# Altium schematic sheet Sheet1.SchDoc
size A4
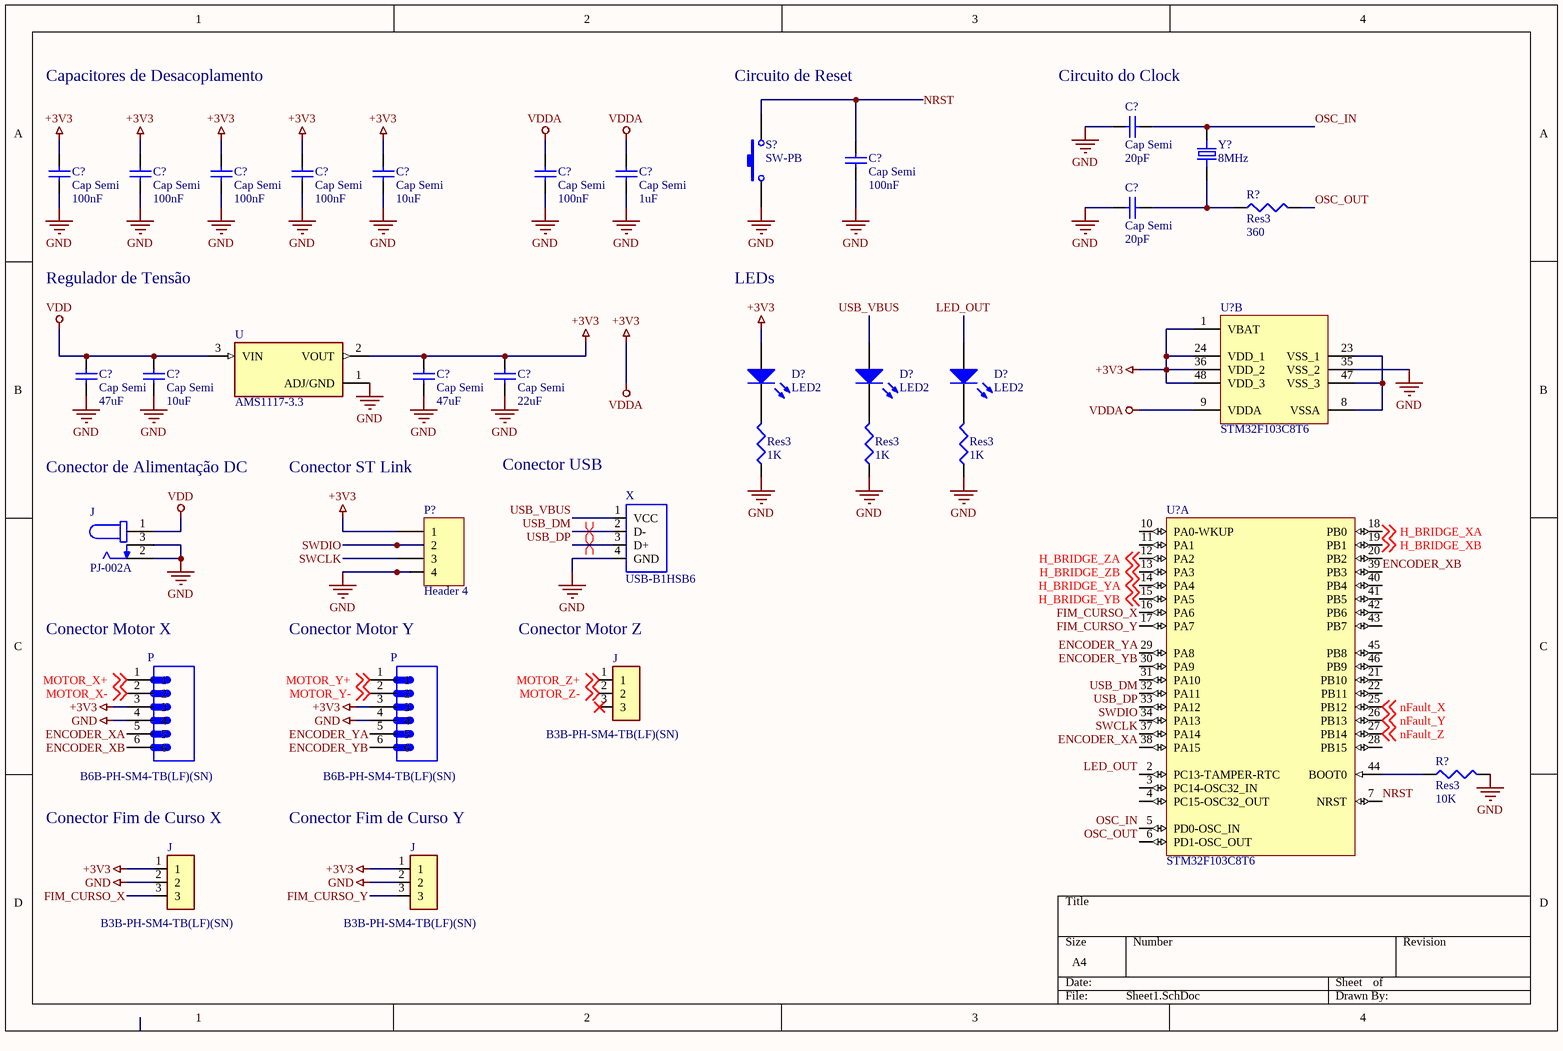
[diagram p0: Sheet1.SchDoc]

## Parts
(Parts that share a designator on the sheet are numbered #1, #2 ... from top to bottom, then left to right.)
?#1  Res3  value 1K  [14-1210]
?#2  Res3  value 1K  [J1-0603]
?#3  Res3  value 1K  [J1-0603]
C?#1  Cap Semi  value 20pF  [C1206]
C?#2  Cap Semi  value 100nF  [C1206]
C?#3  Cap Semi  value 100nF  [C1206]
C?#4  Cap Semi  value 100nF  [C1206]
C?#5  Cap Semi  value 100nF  [C1206]
C?#6  Cap Semi  value 100nF  [C1206]
C?#7  Cap Semi  value 10uF  [C1206]
C?#8  Cap Semi  value 100nF  [C1206]
C?#9  Cap Semi  value 1uF  [C1206]
C?#10  Cap Semi  value 20pF  [C1206]
C?#11  Cap Semi  value 47uF  [C1206]
C?#12  Cap Semi  value 10uF  [C1206]
C?#13  Cap Semi  value 47uF  [C1206]
C?#14  Cap Semi  value 22uF  [C1206]
D?#1  LED2  [3.2X1.6X1.1]
D?#2  LED2  [3.2X1.6X1.1]
D?#3  LED2  [3.2X1.6X1.1]
J#1  PJ-002A  [CUI_PJ-002A]
J#2  B3B-PH-SM4-TB(LF)(SN)  [JST_B3B-PH-SM4-TB(LF)(SN)]
J#3  B3B-PH-SM4-TB(LF)(SN)  [JST_B3B-PH-SM4-TB(LF)(SN)]
J#4  B3B-PH-SM4-TB(LF)(SN)  [JST_B3B-PH-SM4-TB(LF)(SN)]
P#1  B6B-PH-SM4-TB(LF)(SN)  [JST_B6B-PH-SM4-TB(LF)(SN)]
P#2  B6B-PH-SM4-TB(LF)(SN)  [JST_B6B-PH-SM4-TB(LF)(SN)]
P?  Header 4  [HDR1X4]
R?#1  Res3  value 360  [J1-0603]
R?#2  Res3  value 10K  [J1-0603]
S?  SW-PB  [SPST-2]
U  AMS1117-3.3  [SOT229P700X180-4N]
U?#1  STM32F103C8T6  [STM-LQFP48_N]  (part B of 2)
U?#2  STM32F103C8T6  [STM-LQFP48_N]  (part A of 2)
X  USB-B1HSB6  [OST_USB-B1HSB6]
Y?  8MHz  [XTAL_ECS-80-20-5PX-TR]

## Nets
+3V3: C?#3.2 C?#4.2 C?#5.2 C?#6.2 C?#7.2 C?#8.2 C?#9.2 C?#13.2 C?#14.2 D?#1.1(A) J#3.1 J#4.1 P#1.3 P#2.3 P?.1 U.2(VOUT) U?#1.1(VBAT) U?#1.9(VDDA) U?#1.24(VDD_1) U?#1.36(VDD_2) U?#1.48(VDD_3)  [also labelled VDDA]
GND: ?#1.1 ?#2.1 ?#3.1 C?#1.2 C?#2.1 C?#3.1 C?#4.1 C?#5.1 C?#6.1 C?#7.1 C?#8.1 C?#9.1 C?#10.2 C?#11.1 C?#12.1 C?#13.1 C?#14.1 J#1.2 J#1.3 J#3.2 J#4.2 P#1.4 P#2.4 P?.4 R?#2.2 S?.1 U.1(ADJ/GND) U?#1.35(VSS_2) X.4(GND)
VDD: C?#11.2 C?#12.2 J#1.1 U.3(VIN)
ENCODER_XA: P#1.5 U?#2.38(PA15)
ENCODER_XB: P#1.6 U?#2.39(PB3)
ENCODER_YA: P#2.5 U?#2.29(PA8)
ENCODER_YB: P#2.6 U?#2.30(PA9)
FIM_CURSO_X: J#3.3 U?#2.16(PA6)
FIM_CURSO_Y: J#4.3 U?#2.17(PA7)
H_BRIDGE_XA: U?#2.18(PB0) ; off-sheet H_BRIDGE_XA
H_BRIDGE_XB: U?#2.19(PB1) ; off-sheet H_BRIDGE_XB
H_BRIDGE_YA: U?#2.14(PA4) ; off-sheet H_BRIDGE_YA
H_BRIDGE_YB: U?#2.15(PA5) ; off-sheet H_BRIDGE_YB
H_BRIDGE_ZA: U?#2.12(PA2) ; off-sheet H_BRIDGE_ZA
H_BRIDGE_ZB: U?#2.13(PA3) ; off-sheet H_BRIDGE_ZB
LED_OUT: D?#3.1(A) U?#2.2(PC13-TAMPER-RTC)
MOTOR_X+: P#1.1 ; off-sheet MOTOR_X+
MOTOR_X-: P#1.2 ; off-sheet MOTOR_X-
MOTOR_Y+: P#2.1 ; off-sheet MOTOR_Y+
MOTOR_Y-: P#2.2 ; off-sheet MOTOR_Y-
MOTOR_Z+: J#2.1 ; off-sheet MOTOR_Z+
MOTOR_Z-: J#2.2 ; off-sheet MOTOR_Z-
nFault_X: U?#2.25(PB12) ; off-sheet nFault_X
nFault_Y: U?#2.26(PB13) ; off-sheet nFault_Y
nFault_Z: U?#2.27(PB14) ; off-sheet nFault_Z
NRST: C?#2.2 S?.2 U?#2.7(NRST)
OSC_IN: C?#1.1 U?#2.5(PD0-OSC_IN) Y?.1
OSC_OUT: R?#1.2 U?#2.6(PD1-OSC_OUT)
SWCLK: P?.3 U?#2.37(PA14)
SWDIO: P?.2 U?#2.34(PA13)
USB_DM: U?#2.32(PA11) X.2(D-)
USB_DP: U?#2.33(PA12) X.3(D+)
USB_VBUS: D?#2.1(A) X.1(VCC)
Net?#1_2: ?#1.2 D?#1.2(K)
Net?#2_2: ?#2.2 D?#2.2(K)
Net?#3_2: ?#3.2 D?#3.2(K)
NetC?#10_1: C?#10.1 R?#1.1 Y?.2
NetR?#2_1: R?#2.1 U?#2.44(BOOT0)
NetU?#1_8: U?#1.8(VSSA) U?#1.23(VSS_1) U?#1.47(VSS_3)

Not connected (* = marked no-connect by the designer): J#2 3*; U?#2 3(PC14-OSC32_IN) 4(PC15-OSC32_OUT) 10(PA0-WKUP) 11(PA1) 20(PB2) 21(PB10) 22(PB11) 28(PB15) 31(PA10) 40(PB4) 41(PB5) 42(PB6) 43(PB7) 45(PB8) 46(PB9)

## Layout directives
differential pair: USB_DM, USB_DP

## Notes on the sheet
- Capacitores de Desacoplamento
- Circuito de Reset
- Circuito do Clock
- Regulador de Tensão
- LEDs
- Conector de Alimentação DC
- Conector ST Link
- Conector USB
- Conector Motor X
- Conector Motor Y
- Conector Motor Z
- Conector Fim de Curso X
- Conector Fim de Curso Y

## Library data of the parts
?#1-?#3 R?#1 R?#2 = Res3: Resistor; Published: 8-Jun-2000; LatestRevisionDate: 29-May-2009; LatestRevisionNote: IPC-7351 Footprint Added.; PackageReference: J1-0603; Publisher: Altium Limited; PackageDescription: Chip Resistor
C?#1-C?#14 = Cap Semi: Capacitor (Semiconductor SIM Model); Published: 8-Jun-2000; LatestRevisionDate: 29-May-2009; LatestRevisionNote: IPC-7351 Footprint Added.; PackageReference: C1206; Publisher: Altium Limited; PackageDescription: Chip Capacitor
D?#1-D?#3 = LED2: Typical RED, GREEN, YELLOW, AMBER GaAs LED; Published: 8-Jun-2000; LatestRevisionDate: 17-Jul-2002; LatestRevisionNote: Re-released for DXP Platform.; PackageVersion: Feb-2002; PackageReference: 3.2X1.6X1.1; Publisher: Altium Limited; PackageDescription: SM LED; 2 Flat Leads
J#1 = PJ-002A: 2,0 x 6,5 mm, 2,5 A, Yatay, AÃ§Ä±k Delik, Dc GÃ¼Ã§ JakÄ± KonnektÃ¶rÃ¼; MF: CUI Devices; Package: None; Price: None; CUI_purchase_URL: https://www.cuidevices.com/product/interconnect/connectors/dc-power-connectors/jacks/pj-002a?utm_source=snapeda.com&utm_medium=referral&utm_campaign=snapedaBOM; SnapEDA_Link: https://www.snapeda.com/parts/PJ-002A/CUI%20Devices/view-part/287588/?ref=snap; Availability: Unavailable; Value: *; MP: PJ-002A
J#2-J#4 = B3B-PH-SM4-TB(LF)(SN): Connector Header Surface Mount 3 position 0.079 _2.00mm_; MF: JST Sales; MP: B3B-PH-SM4-TB_LF__SN_; Digi-Key_Part_Number: 455-1735-1-ND; Digi-Key_Purchase_URL: https://www.digikey.com/product-detail/en/jst-sales-america-inc/B3B-PH-SM4-TB_LF__SN_/455-1735-1-ND/926832?utm_source=snapeda&utm_medium=aggregator&utm_campaign=symbol; Value: *; SnapEDA_Link: https://www.snapeda.com/parts/B3B-PH-SM4-TB%28LF%29%28SN%29/JST%20Sales%20America%20Inc./view-part/53135/?ref=snap; Package: 2010 JST
P#1 P#2 = B6B-PH-SM4-TB(LF)(SN): Connector Header Surface Mount 6 position 0.079 _2.00mm_; MF: JST Sales; MP: B6B-PH-SM4-TB_LF__SN_; Value: *; Price: None; Package: None; SnapEDA_Link: https://www.snapeda.com/parts/B6B-PH-SM4-TB%28LF%29%28SN%29/JST%20Sales%20America%20Inc./view-part/52131/?ref=snap; Availability: Unavailable
P? = Header 4: Header, 4-Pin; LatestRevisionDate: 17-Jul-2002; LatestRevisionNote: Re-released for DXP Platform.; Publisher: Altium Limited
S? = SW-PB: Switch; Published: 24-Mar-1999; LatestRevisionDate: 17-Jul-2002; LatestRevisionNote: Re-released for DXP Platform.; PackageReference: SPST-2; Publisher: Altium Limited; PackageDescription: Switch; 2 Leads
U = AMS1117-3.3: Sot223/Pkg 1-Amp 3.3-Volt Low Drop Out Voltage Regulatator; MF: Advanced Monolithic Systems; Price: None; Package: None; Value: *; MP: AMS1117-3.3; Availability: Unavailable; SnapEDA_Link: https://www.snapeda.com/parts/AMS1117-3.3/Advanced%20Monolithic%20Systems/view-part/53450/?ref=snap
U?#1 U?#2 = STM32F103C8T6: ARM Cortex-M3 32-bit MCU, 64 KB Flash, 20 KB Internal RAM, 37 I/Os, 48-pin LQFP, -40 to 85 degC, Tray; A/D Converter: 2x12-bit (10 Channel); FLASH Size (Prog) (kB): 64; I/Os (High Current): 37; Internal RAM Size (kB): 20; Operating Frequency(F) (Processor speed) (MHz): 72; Supply Voltage(Vcc) min (V): 2; DatasheetVersion: Rev. 16; PackageVersion: Rev. 6, 06/2013; PackageReference: LQFP48; PackageDescription: 48-Pin Low Profile Quad Flat Package, 7 x 7 mm Body, 0.5 mm Pitch; Supplier 1: Digi-Key; Supplier Part Number 1: 497-6063-ND; Supplier 2: Farnell; Supplier Part Number 2: 1447637; Supplier 3: Newark; Supplier Part Number 3: 59M2182; Supplier 4: Newark; Supplier Part Number 4: 57P1222; Supplier 5: Mouser; Supplier Part Number 5: 511-STM32F103C8T6; Core: ARM Cortex-M3; Packing: Tray; Mounting Technology: Surface Mount; PartNumber: STM32F103C8T6; ComponentLink1Description: Manufacturer URL; ComponentLink1URL: http://www.st.com/web/en/home.html; ComponentLink2Description: Datasheet; ComponentLink2URL: http://www.st.com/st-web-ui/static/active/en/resource/technical/document/datasheet/CD00161566.pdf; ComponentLink3Description: Package Specification; ComponentLink3URL: http://www.st.com/st-web-ui/static/active/en/resource/technical/document/datasheet/DM00058181.pdf
X = USB-B1HSB6: USB-B _USB TYPE-B_ Receptacle Connector 4 Position Through Hole, Right Angle; MF: On Shore; Value: *; SnapEDA_Link: https://www.snapeda.com/parts/USB-B1HSB6/On%20Shore%20Technology%20Inc./view-part/227661/?ref=snap; Digi-Key_Purchase_URL: https://www.digikey.com/product-detail/en/on-shore-technology-inc/USB-B1HSB6/ED2983-ND/2677744?utm_source=snapeda&utm_medium=aggregator&utm_campaign=symbol; MP: USB-B1HSB6; Digi-Key_Part_Number: ED2983-ND; Package: None
Y? = ECS-80-20-5PX-TR: 8MHz Â±30ppm Crystal 20pF 60 Ohms HC-49/US; MF: ECS Inc.; Package: HC-49/US ECS International; MP: ECS-80-20-5PX-TR; Value: *; SnapEDA_Link: https://www.snapeda.com/parts/ECS-80-20-5PX-TR/ECS%20Inc./view-part/2460571/?ref=snap; Digi-Key_Purchase_URL: https://www.digikey.in/product-detail/en/ecs-inc/ECS-80-20-5PX-TR/XC2076CT-ND/5875560?utm_source=snapeda&utm_medium=aggregator&utm_campaign=symbol; Digi-Key_Part_Number: XC2076CT-ND